# Altium schematic sheet uMultimeter_OLED_Sch.SchDoc: MicroMultimeter - OLED
size 127 x 101 mm; Author: Hom; CompanyName: KitSprout; DrawnBy: Hom; Engineer: Hom; Organization: KitSprout; Revision: B; SheetNumber: 1; SheetTotal: 1; License: CC BY-SA 4.0; Version: 2.0; LibVersion: 2.1; PageSetup: Record=PageOptions|CenterHorizontal=True|CenterVertical=True|PrintScale=1.00|XCorrection=1.00|YCorrection=1.00|PrintKind=0|BorderSize=5000000|LeftOffset=0|BottomOffset=0|Orientation=2|PaperLength=1000|PaperWidth=1000|Scale=100|PaperSource=7|PrintQuality=-3|MediaType=1|DitherType=10|PrintScaleMode=0|PaperKind=A4|PaperIndex=9
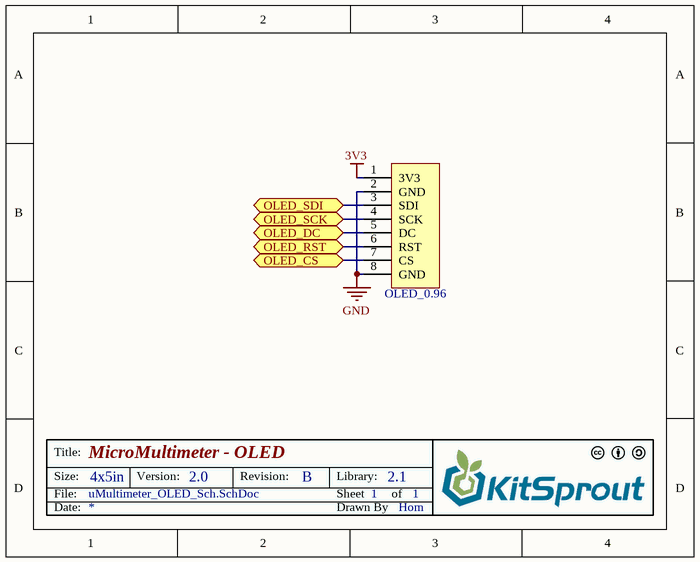
[diagram p0: uMultimeter_OLED_Sch.SchDoc]

## Parts
OLED_0.96  OLED_0.96  [OLED_0.96_96x64_v2]  (value not drawn)

## Ports
OLED_CS, OLED_DC, OLED_RST, OLED_SCK, OLED_SDI

## Nets
3V3: OLED_0.96.1(3V3)
GND: OLED_0.96.2(GND) OLED_0.96.8(GND)
OLED_CS: OLED_0.96.7(CS) ; port OLED_CS
OLED_DC: OLED_0.96.5(DC) ; port OLED_DC
OLED_RST: OLED_0.96.6(RST) ; port OLED_RST
OLED_SCK: OLED_0.96.4(SCK) ; port OLED_SCK
OLED_SDI: OLED_0.96.3(SDI) ; port OLED_SDI

## Notes on the sheet
- Title:
- Size:
- Date:
- File:
- 4x5in
- Version:
- Revision:
- Sheet
- Drawn By
- Library:
- of

## Library data of the parts
OLED_0.96 = OLED_0.96_96*64_v2: Module